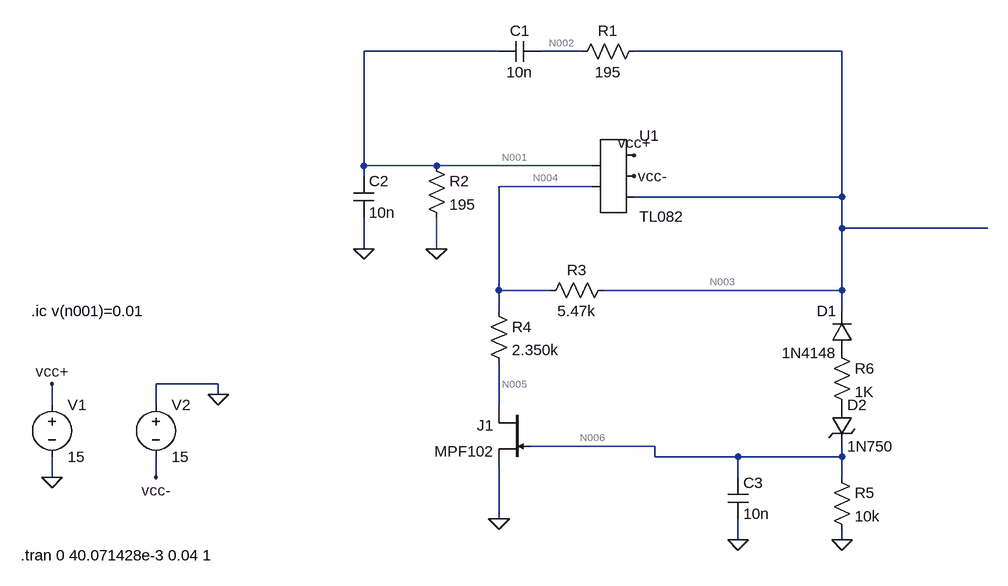
[diagram p0: schematic Circuito.asc]
* Circuito.asc
R1 N003 N002 195
C1 N002 N001 10n V=0
C2 N001 0 10n
R2 N001 0 195
R3 N003 N004 5.47k
D1 P001 N003 1N4148
D2 P002 N006 1N750
R5 N006 0 10k
C3 N006 0 10n
V1 vcc+ 0 15
V2 0 vcc- 15
R4 N004 N005 2.350k
J1 N005 N006 0 MPF102
* U1: TL082 (symbol AutoGenerated\TL082 not available, pins judged from their places): pin1=N001 pin2=N004 pin3=vcc+ pin4=vcc- pin5=N003
R6 P001 P002 1K
.model D D
.lib standard.dio
.model NJF NJF
.model PJF PJF
.lib standard.jft
.tran 0 40.071428e-3 0.04 1
.ic v(n001)=0.01
.backanno
.end

* Results of the author's LTspice run, read from the files saved beside the schematic
* Operating Point, zero values left out:
*   V(n003) = 31.98 mV
*   V(n002) = 31.98 mV
*   V(n001) = 10 mV
*   V(n004) = 10.01 mV
*   V(p001) = 12.83 mV
*   V(p002) = 12.83 mV
*   V(n006) = 8.684 µV
*   V(vcc+) = 15 V
*   V(vcc-) = -15 V
*   V(n005) = 574.2 µV
*   I(D2) = 868.3 pA
*   I(D1) = -868.3 pA
*   Id(J1) = 4.015 µA
*   Is(J1) = -4.015 µA
*   I(R6) = 868.3 pA
*   I(R4) = 4.015 µA
*   I(R5) = 868.4 pA
*   I(R3) = 4.016 µA
*   I(R2) = 51.28 µA
*   I(V2) = -14.19 mA
*   I(V1) = -14.19 mA
*   Ix(u1:1) = 45.06 pA
*   Ix(u1:2) = 45.06 pA
*   Ix(u1:3) = 14.19 mA
*   Ix(u1:4) = -14.19 mA
*   Ix(u1:5) = -4.016 µA
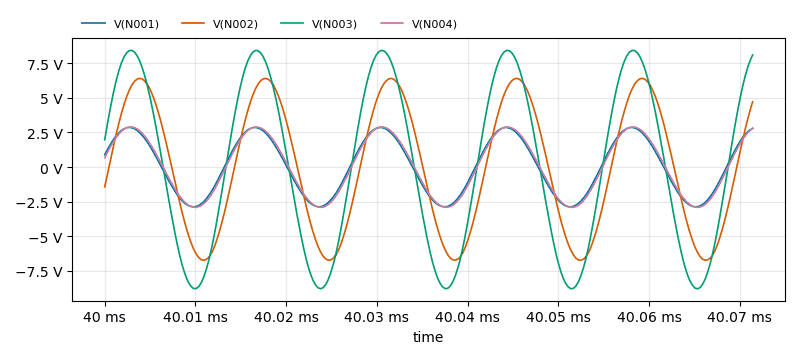
[diagram p1: Transient Analysis of Circuito.asc, plotted from the saved traces]
* Transient Analysis, 1 run:
*   V(N001): min -2.868 V, max 2.866 V, average 61.6 mV, rms 2.028 V, last 2.806 V
*   V(N002): min -6.728 V, max 6.41 V, average -25 mV, rms 4.602 V, last 4.716 V
*   V(N003): min -8.787 V, max 8.43 V, average 88.75 mV, rms 6.089 V, last 8.094 V
*   V(N004): min -2.908 V, max 2.901 V, average 57.61 mV, rms 2.051 V, last 2.787 V